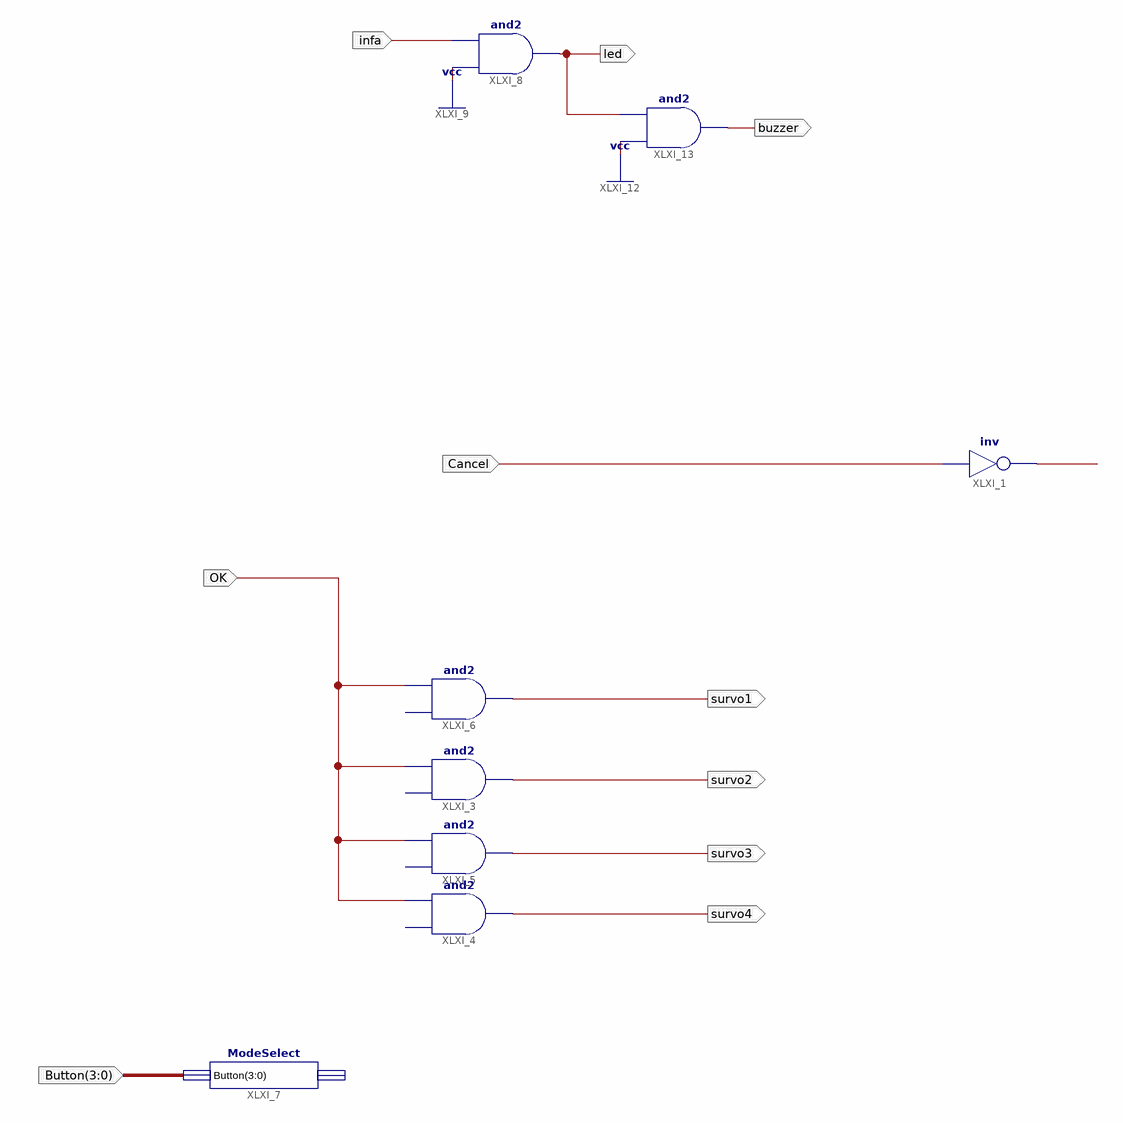
[diagram p0: schematic sheet 1]
// Xilinx ISE schematic main.sch (spartan6) as structural Verilog: 8 symbols, 10 ports
module main (
  input  Cancel,
  input  OK,
  input  infa,
  input  [3:0] Button,
  output survo1,
  output survo2,
  output survo3,
  output survo4,
  output led,
  output buzzer
);

  wire XLXN_24;

  not XLXI_1 (XLXN_24, Cancel);
  buf XLXI_3 (survo2, OK);  // and2 open: I0
  buf XLXI_4 (survo4, OK);  // and2 open: I0
  buf XLXI_5 (survo3, OK);  // and2 open: I0
  buf XLXI_6 (survo1, OK);  // and2 open: I0
  and XLXI_8 (led, 1'b1, infa);
  and XLXI_13 (buzzer, 1'b1, led);
  ModeSelect XLXI_7 (.Button(Button));  // open: Mode
endmodule
